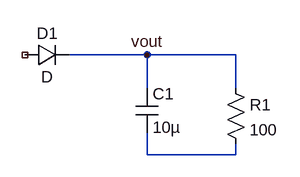
[diagram p0: schematic Draft2.asc]
Draft2.asc, the LTspice schematic file:
Version 4.1
SHEET 1 880 680
WIRE 224 96 112 96
WIRE 352 96 224 96
WIRE 224 144 224 96
WIRE 352 144 352 96
WIRE 224 240 224 208
WIRE 352 240 352 224
WIRE 352 240 224 240
FLAG 224 96 vout
SYMBOL diode 48 112 R270
WINDOW 0 32 32 VTop 2
WINDOW 3 0 32 VBottom 2
SYMATTR InstName D1
SYMBOL cap 208 144 R0
SYMATTR InstName C1
SYMATTR Value 10µ
SYMBOL res 336 128 R0
SYMATTR InstName R1
SYMATTR Value 100

The netlist it stands for:
* Draft2.asc
D1 NC_01 vout D
C1 vout N001 10µ
R1 vout N001 100
.model D D
.lib standard.dio
.backanno
.end